# Altium schematic sheet FPGA_SDRAM1.SchDoc: RFSOC_AMC
size 420 x 297 mm; Author: G.Kasprowicz; CompanyName: WUT ISE; DrawnBy: G.Kasprowicz; Organization: WUT ISE; Address1: PW ISE; Address2: Nowowiejska 15/19 00-665 Warsaw; Address3: gkasprow@gmail.com; DocumentNumber: 12; Revision: 2; SheetNumber: 13; SheetTotal: 54; ModifiedBy: -; CheckedDate: -; Title2: 8 channel ADC & DAC; DivGrp: WUT ISE; Designer: G.Kasprowicz; ModifiedDate: -; ProjectName: Sensor Box
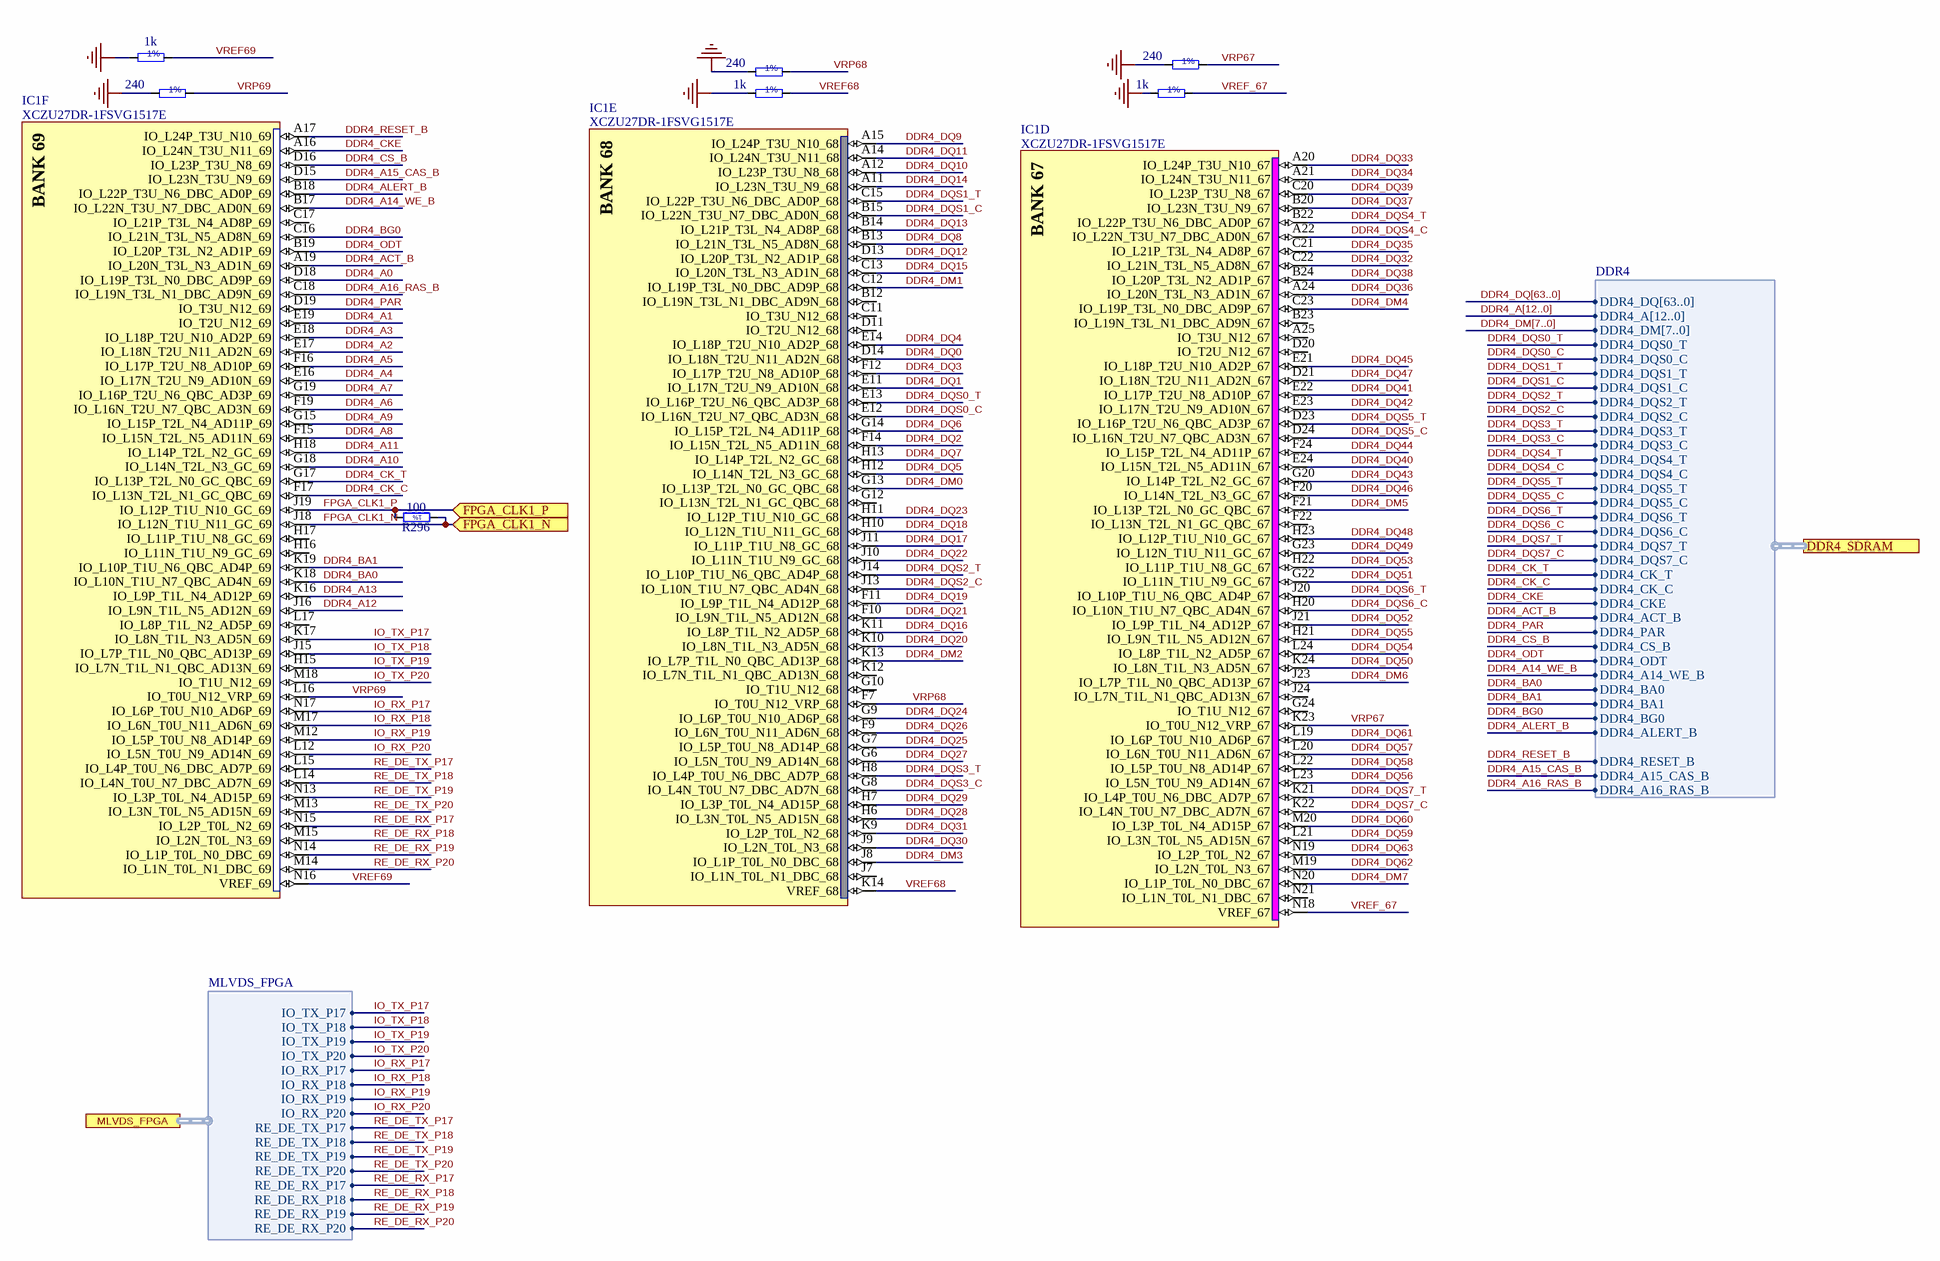
[diagram p0: FPGA_SDRAM1.SchDoc]

## Parts
IC1  XCZU27DR-1FSVG1517E  [XILINX_FSVG1517 (XCZU27DR)]  (parts D,E,F of 31)
R293  240
R294  240
R295  240
R296  100  [RESC1005X40N]
R400  1k
R451  1k
R452  1k

## Ports
DDR4_SDRAM (harness DDR4), FPGA_CLK1_N (in), FPGA_CLK1_P (in), MLVDS_FPGA (harness MLVDS_FPGA)

## Harnesses
DDR4: DDR4_DQ[63..0], DDR4_A[12..0], DDR4_DM[7..0], DDR4_DQS0_T, DDR4_DQS0_C, DDR4_DQS1_T, DDR4_DQS1_C, DDR4_DQS2_T, DDR4_DQS2_C, DDR4_DQS3_T, DDR4_DQS3_C, DDR4_DQS4_T, DDR4_DQS4_C, DDR4_DQS5_T, DDR4_DQS5_C, DDR4_DQS6_T, DDR4_DQS6_C, DDR4_DQS7_T, DDR4_DQS7_C, DDR4_CK_T, DDR4_CK_C, DDR4_CKE, DDR4_ACT_B, DDR4_PAR, DDR4_CS_B, DDR4_ODT, DDR4_A14_WE_B, DDR4_BA0, DDR4_BA1, DDR4_BG0, DDR4_ALERT_B, DDR4_RESET_B, DDR4_A15_CAS_B, DDR4_A16_RAS_B
MLVDS_FPGA: IO_TX_P17, IO_TX_P18, IO_TX_P19, IO_TX_P20, IO_RX_P17, IO_RX_P18, IO_RX_P19, IO_RX_P20, RE_DE_TX_P17, RE_DE_TX_P18, RE_DE_TX_P19, RE_DE_TX_P20, RE_DE_RX_P17, RE_DE_RX_P18, RE_DE_RX_P19, RE_DE_RX_P20

## Nets
GND: R293.1 R294.1 R295.1 R400.1 R451.1 R452.1
DDR4_A0: IC1.D18(IO_L19P_T3L_N0_DBC_AD9P_69)
DDR4_A1: IC1.E19(IO_T2U_N12_69)
DDR4_A2: IC1.E17(IO_L18N_T2U_N11_AD2N_69)
DDR4_A3: IC1.E18(IO_L18P_T2U_N10_AD2P_69)
DDR4_A4: IC1.E16(IO_L17N_T2U_N9_AD10N_69)
DDR4_A5: IC1.F16(IO_L17P_T2U_N8_AD10P_69)
DDR4_A6: IC1.F19(IO_L16N_T2U_N7_QBC_AD3N_69)
DDR4_A7: IC1.G19(IO_L16P_T2U_N6_QBC_AD3P_69)
DDR4_A8: IC1.F15(IO_L15N_T2L_N5_AD11N_69)
DDR4_A9: IC1.G15(IO_L15P_T2L_N4_AD11P_69)
DDR4_A10: IC1.G18(IO_L14N_T2L_N3_GC_69)
DDR4_A11: IC1.H18(IO_L14P_T2L_N2_GC_69)
DDR4_A12: IC1.J16(IO_L9N_T1L_N5_AD12N_69)
DDR4_A13: IC1.K16(IO_L9P_T1L_N4_AD12P_69)
DDR4_A14_WE_B: IC1.B17(IO_L22N_T3U_N7_DBC_AD0N_69) ; port DDR4_SDRAM.DDR4_A14_WE_B
DDR4_A15_CAS_B: IC1.D15(IO_L23N_T3U_N9_69) ; port DDR4_SDRAM.DDR4_A15_CAS_B
DDR4_A16_RAS_B: IC1.C18(IO_L19N_T3L_N1_DBC_AD9N_69) ; port DDR4_SDRAM.DDR4_A16_RAS_B
DDR4_ACT_B: IC1.A19(IO_L20N_T3L_N3_AD1N_69) ; port DDR4_SDRAM.DDR4_ACT_B
DDR4_ALERT_B: IC1.B18(IO_L22P_T3U_N6_DBC_AD0P_69) ; port DDR4_SDRAM.DDR4_ALERT_B
DDR4_BA0: IC1.K18(IO_L10N_T1U_N7_QBC_AD4N_69) ; port DDR4_SDRAM.DDR4_BA0
DDR4_BA1: IC1.K19(IO_L10P_T1U_N6_QBC_AD4P_69) ; port DDR4_SDRAM.DDR4_BA1
DDR4_BG0: IC1.C16(IO_L21N_T3L_N5_AD8N_69) ; port DDR4_SDRAM.DDR4_BG0
DDR4_CK_C: IC1.F17(IO_L13N_T2L_N1_GC_QBC_69) ; port DDR4_SDRAM.DDR4_CK_C
DDR4_CK_T: IC1.G17(IO_L13P_T2L_N0_GC_QBC_69) ; port DDR4_SDRAM.DDR4_CK_T
DDR4_CKE: IC1.A16(IO_L24N_T3U_N11_69) ; port DDR4_SDRAM.DDR4_CKE
DDR4_CS_B: IC1.D16(IO_L23P_T3U_N8_69) ; port DDR4_SDRAM.DDR4_CS_B
DDR4_DM0: IC1.G13(IO_L13P_T2L_N0_GC_QBC_68)
DDR4_DM1: IC1.C12(IO_L19P_T3L_N0_DBC_AD9P_68)
DDR4_DM2: IC1.K13(IO_L7P_T1L_N0_QBC_AD13P_68)
DDR4_DM3: IC1.J8(IO_L1P_T0L_N0_DBC_68)
DDR4_DM4: IC1.C23(IO_L19P_T3L_N0_DBC_AD9P_67)
DDR4_DM5: IC1.F21(IO_L13P_T2L_N0_GC_QBC_67)
DDR4_DM6: IC1.J23(IO_L7P_T1L_N0_QBC_AD13P_67)
DDR4_DM7: IC1.N20(IO_L1P_T0L_N0_DBC_67)
DDR4_DQ0: IC1.D14(IO_L18N_T2U_N11_AD2N_68)
DDR4_DQ1: IC1.E11(IO_L17N_T2U_N9_AD10N_68)
DDR4_DQ2: IC1.F14(IO_L15N_T2L_N5_AD11N_68)
DDR4_DQ3: IC1.F12(IO_L17P_T2U_N8_AD10P_68)
DDR4_DQ4: IC1.E14(IO_L18P_T2U_N10_AD2P_68)
DDR4_DQ5: IC1.H12(IO_L14N_T2L_N3_GC_68)
DDR4_DQ6: IC1.G14(IO_L15P_T2L_N4_AD11P_68)
DDR4_DQ7: IC1.H13(IO_L14P_T2L_N2_GC_68)
DDR4_DQ8: IC1.B13(IO_L21N_T3L_N5_AD8N_68)
DDR4_DQ9: IC1.A15(IO_L24P_T3U_N10_68)
DDR4_DQ10: IC1.A12(IO_L23P_T3U_N8_68)
DDR4_DQ11: IC1.A14(IO_L24N_T3U_N11_68)
DDR4_DQ12: IC1.D13(IO_L20P_T3L_N2_AD1P_68)
DDR4_DQ13: IC1.B14(IO_L21P_T3L_N4_AD8P_68)
DDR4_DQ14: IC1.A11(IO_L23N_T3U_N9_68)
DDR4_DQ15: IC1.C13(IO_L20N_T3L_N3_AD1N_68)
DDR4_DQ16: IC1.K11(IO_L8P_T1L_N2_AD5P_68)
DDR4_DQ17: IC1.J11(IO_L11P_T1U_N8_GC_68)
DDR4_DQ18: IC1.H10(IO_L12N_T1U_N11_GC_68)
DDR4_DQ19: IC1.F11(IO_L9P_T1L_N4_AD12P_68)
DDR4_DQ20: IC1.K10(IO_L8N_T1L_N3_AD5N_68)
DDR4_DQ21: IC1.F10(IO_L9N_T1L_N5_AD12N_68)
DDR4_DQ22: IC1.J10(IO_L11N_T1U_N9_GC_68)
DDR4_DQ23: IC1.H11(IO_L12P_T1U_N10_GC_68)
DDR4_DQ24: IC1.G9(IO_L6P_T0U_N10_AD6P_68)
DDR4_DQ25: IC1.G7(IO_L5P_T0U_N8_AD14P_68)
DDR4_DQ26: IC1.F9(IO_L6N_T0U_N11_AD6N_68)
DDR4_DQ27: IC1.G6(IO_L5N_T0U_N9_AD14N_68)
DDR4_DQ28: IC1.H6(IO_L3N_T0L_N5_AD15N_68)
DDR4_DQ29: IC1.H7(IO_L3P_T0L_N4_AD15P_68)
DDR4_DQ30: IC1.J9(IO_L2N_T0L_N3_68)
DDR4_DQ31: IC1.K9(IO_L2P_T0L_N2_68)
DDR4_DQ32: IC1.C22(IO_L21N_T3L_N5_AD8N_67)
DDR4_DQ33: IC1.A20(IO_L24P_T3U_N10_67)
DDR4_DQ34: IC1.A21(IO_L24N_T3U_N11_67)
DDR4_DQ35: IC1.C21(IO_L21P_T3L_N4_AD8P_67)
DDR4_DQ36: IC1.A24(IO_L20N_T3L_N3_AD1N_67)
DDR4_DQ37: IC1.B20(IO_L23N_T3U_N9_67)
DDR4_DQ38: IC1.B24(IO_L20P_T3L_N2_AD1P_67)
DDR4_DQ39: IC1.C20(IO_L23P_T3U_N8_67)
DDR4_DQ40: IC1.E24(IO_L15N_T2L_N5_AD11N_67)
DDR4_DQ41: IC1.E22(IO_L17P_T2U_N8_AD10P_67)
DDR4_DQ42: IC1.E23(IO_L17N_T2U_N9_AD10N_67)
DDR4_DQ43: IC1.G20(IO_L14P_T2L_N2_GC_67)
DDR4_DQ44: IC1.F24(IO_L15P_T2L_N4_AD11P_67)
DDR4_DQ45: IC1.E21(IO_L18P_T2U_N10_AD2P_67)
DDR4_DQ46: IC1.F20(IO_L14N_T2L_N3_GC_67)
DDR4_DQ47: IC1.D21(IO_L18N_T2U_N11_AD2N_67)
DDR4_DQ48: IC1.H23(IO_L12P_T1U_N10_GC_67)
DDR4_DQ49: IC1.G23(IO_L12N_T1U_N11_GC_67)
DDR4_DQ50: IC1.K24(IO_L8N_T1L_N3_AD5N_67)
DDR4_DQ51: IC1.G22(IO_L11N_T1U_N9_GC_67)
DDR4_DQ52: IC1.J21(IO_L9P_T1L_N4_AD12P_67)
DDR4_DQ53: IC1.H22(IO_L11P_T1U_N8_GC_67)
DDR4_DQ54: IC1.L24(IO_L8P_T1L_N2_AD5P_67)
DDR4_DQ55: IC1.H21(IO_L9N_T1L_N5_AD12N_67)
DDR4_DQ56: IC1.L23(IO_L5N_T0U_N9_AD14N_67)
DDR4_DQ57: IC1.L20(IO_L6N_T0U_N11_AD6N_67)
DDR4_DQ58: IC1.L22(IO_L5P_T0U_N8_AD14P_67)
DDR4_DQ59: IC1.L21(IO_L3N_T0L_N5_AD15N_67)
DDR4_DQ60: IC1.M20(IO_L3P_T0L_N4_AD15P_67)
DDR4_DQ61: IC1.L19(IO_L6P_T0U_N10_AD6P_67)
DDR4_DQ62: IC1.M19(IO_L2N_T0L_N3_67)
DDR4_DQ63: IC1.N19(IO_L2P_T0L_N2_67)
DDR4_DQS0_C: IC1.E12(IO_L16N_T2U_N7_QBC_AD3N_68) ; port DDR4_SDRAM.DDR4_DQS0_C
DDR4_DQS0_T: IC1.E13(IO_L16P_T2U_N6_QBC_AD3P_68) ; port DDR4_SDRAM.DDR4_DQS0_T
DDR4_DQS1_C: IC1.B15(IO_L22N_T3U_N7_DBC_AD0N_68) ; port DDR4_SDRAM.DDR4_DQS1_C
DDR4_DQS1_T: IC1.C15(IO_L22P_T3U_N6_DBC_AD0P_68) ; port DDR4_SDRAM.DDR4_DQS1_T
DDR4_DQS2_C: IC1.J13(IO_L10N_T1U_N7_QBC_AD4N_68) ; port DDR4_SDRAM.DDR4_DQS2_C
DDR4_DQS2_T: IC1.J14(IO_L10P_T1U_N6_QBC_AD4P_68) ; port DDR4_SDRAM.DDR4_DQS2_T
DDR4_DQS3_C: IC1.G8(IO_L4N_T0U_N7_DBC_AD7N_68) ; port DDR4_SDRAM.DDR4_DQS3_C
DDR4_DQS3_T: IC1.H8(IO_L4P_T0U_N6_DBC_AD7P_68) ; port DDR4_SDRAM.DDR4_DQS3_T
DDR4_DQS4_C: IC1.A22(IO_L22N_T3U_N7_DBC_AD0N_67) ; port DDR4_SDRAM.DDR4_DQS4_C
DDR4_DQS4_T: IC1.B22(IO_L22P_T3U_N6_DBC_AD0P_67) ; port DDR4_SDRAM.DDR4_DQS4_T
DDR4_DQS5_C: IC1.D24(IO_L16N_T2U_N7_QBC_AD3N_67) ; port DDR4_SDRAM.DDR4_DQS5_C
DDR4_DQS5_T: IC1.D23(IO_L16P_T2U_N6_QBC_AD3P_67) ; port DDR4_SDRAM.DDR4_DQS5_T
DDR4_DQS6_C: IC1.H20(IO_L10N_T1U_N7_QBC_AD4N_67) ; port DDR4_SDRAM.DDR4_DQS6_C
DDR4_DQS6_T: IC1.J20(IO_L10P_T1U_N6_QBC_AD4P_67) ; port DDR4_SDRAM.DDR4_DQS6_T
DDR4_DQS7_C: IC1.K22(IO_L4N_T0U_N7_DBC_AD7N_67) ; port DDR4_SDRAM.DDR4_DQS7_C
DDR4_DQS7_T: IC1.K21(IO_L4P_T0U_N6_DBC_AD7P_67) ; port DDR4_SDRAM.DDR4_DQS7_T
DDR4_ODT: IC1.B19(IO_L20P_T3L_N2_AD1P_69) ; port DDR4_SDRAM.DDR4_ODT
DDR4_PAR: IC1.D19(IO_T3U_N12_69) ; port DDR4_SDRAM.DDR4_PAR
DDR4_RESET_B: IC1.A17(IO_L24P_T3U_N10_69) ; port DDR4_SDRAM.DDR4_RESET_B
FPGA_CLK1_N: IC1.J18(IO_L12N_T1U_N11_GC_69) R296.2 ; port FPGA_CLK1_N
FPGA_CLK1_P: IC1.J19(IO_L12P_T1U_N10_GC_69) R296.1 ; port FPGA_CLK1_P
IO_RX_P17: IC1.N17(IO_L6P_T0U_N10_AD6P_69) ; port MLVDS_FPGA.IO_RX_P17
IO_RX_P18: IC1.M17(IO_L6N_T0U_N11_AD6N_69) ; port MLVDS_FPGA.IO_RX_P18
IO_RX_P19: IC1.M12(IO_L5P_T0U_N8_AD14P_69) ; port MLVDS_FPGA.IO_RX_P19
IO_RX_P20: IC1.L12(IO_L5N_T0U_N9_AD14N_69) ; port MLVDS_FPGA.IO_RX_P20
IO_TX_P17: IC1.K17(IO_L8N_T1L_N3_AD5N_69) ; port MLVDS_FPGA.IO_TX_P17
IO_TX_P18: IC1.J15(IO_L7P_T1L_N0_QBC_AD13P_69) ; port MLVDS_FPGA.IO_TX_P18
IO_TX_P19: IC1.H15(IO_L7N_T1L_N1_QBC_AD13N_69) ; port MLVDS_FPGA.IO_TX_P19
IO_TX_P20: IC1.M18(IO_T1U_N12_69) ; port MLVDS_FPGA.IO_TX_P20
RE_DE_RX_P17: IC1.N15(IO_L2P_T0L_N2_69) ; port MLVDS_FPGA.RE_DE_RX_P17
RE_DE_RX_P18: IC1.M15(IO_L2N_T0L_N3_69) ; port MLVDS_FPGA.RE_DE_RX_P18
RE_DE_RX_P19: IC1.N14(IO_L1P_T0L_N0_DBC_69) ; port MLVDS_FPGA.RE_DE_RX_P19
RE_DE_RX_P20: IC1.M14(IO_L1N_T0L_N1_DBC_69) ; port MLVDS_FPGA.RE_DE_RX_P20
RE_DE_TX_P17: IC1.L15(IO_L4P_T0U_N6_DBC_AD7P_69) ; port MLVDS_FPGA.RE_DE_TX_P17
RE_DE_TX_P18: IC1.L14(IO_L4N_T0U_N7_DBC_AD7N_69) ; port MLVDS_FPGA.RE_DE_TX_P18
RE_DE_TX_P19: IC1.N13(IO_L3P_T0L_N4_AD15P_69) ; port MLVDS_FPGA.RE_DE_TX_P19
RE_DE_TX_P20: IC1.M13(IO_L3N_T0L_N5_AD15N_69) ; port MLVDS_FPGA.RE_DE_TX_P20
VREF68: IC1.K14(VREF_68) R451.2
VREF69: IC1.N16(VREF_69) R400.2
VREF_67: IC1.N18(VREF_67) R452.2
VRP67: IC1.K23(IO_T0U_N12_VRP_67) R295.2
VRP68: IC1.F7(IO_T0U_N12_VRP_68) R294.2
VRP69: IC1.L16(IO_T0U_N12_VRP_69) R293.2

Not connected (* = marked no-connect by the designer): IC1 A25(IO_T3U_N12_67) B12(IO_L19N_T3L_N1_DBC_AD9N_68) B23(IO_L19N_T3L_N1_DBC_AD9N_67) C11(IO_T3U_N12_68) C17(IO_L21P_T3L_N4_AD8P_69) D11(IO_T2U_N12_68) D20(IO_T2U_N12_67) F22(IO_L13N_T2L_N1_GC_QBC_67) G10(IO_T1U_N12_68) G12(IO_L13N_T2L_N1_GC_QBC_68) G24(IO_T1U_N12_67) H16(IO_L11N_T1U_N9_GC_69) H17(IO_L11P_T1U_N8_GC_69) J7(IO_L1N_T0L_N1_DBC_68) J24(IO_L7N_T1L_N1_QBC_AD13N_67) K12(IO_L7N_T1L_N1_QBC_AD13N_68) L17(IO_L8P_T1L_N2_AD5P_69) N21(IO_L1N_T0L_N1_DBC_67)

## Buses and harness runs
bus DDR4_A[12..0]
bus DDR4_DM[7..0]
bus DDR4_DQ[63..0]

## Notes on the sheet
- Project/Equipment
- Document
- Designer
- Drawn by
- Check.by
- Copyright WUT ISE 2019.
  This documentation describes Open Hardware and is licensed under the CERN OHL v.1.1. You may redistribute and modify this documentation under the terms of the CERN OHL v.1.1. (http://ohwr.org/CERNOHL). This documentation is distributed WITHOUT ANY EXPRESS OR IMPLIED WARRANTY, INCLUDING OF MERCHANTABILITY, SATISFACTORY QUALITY AND FITNESS FOR A PARTICULAR PURPOSE. Please see the CERN OHL v.1.1 for applicable conditions.
- Contact
- File
- Last Mod.
- Print Date
- Sheet
- Size
- A3
- of
- Rev
- (in symbol R293) 1%
- (in symbol R294) 1%
- (in symbol R295) 1%
- (in symbol R400) 1%
- (in symbol R0402_100R_1%_0.0625W_100PPM) 1%
- (in symbol R451) 1%
- (in symbol R452) 1%
- (in symbol XCZU27DR-1FSVG1517E, part D) BANK 67
- (in symbol XCZU27DR-1FSVG1517E, part E) BANK 68
- (in symbol XCZU27DR-1FSVG1517E, part F) BANK 69

## Library data of the parts
IC1 = XCZU27DR-1FSVG1517E: Zynq UltraScale+ RFSoC, Quad-Core ARM® Cortex™-A53 MPCore™ up to 1.5GHz, 214 PS I/O, 299 HP I/O, 48 HD I/O, 1517-Pin BGA; Manufacturer: XILINX; PressFit: No; Bonding: No; Part Number: XCZU27DR-1FSVG1517E; Component Kind: Standard; Component Type: Standard; Device: XCZU27DR-1FSVG1517E; PackageDescription: BGA, 1.00mm Pitch, Square; 1517 Pin, 39 Columns X 39 Rows, 40.00mm X 40.00mm X 4.01mm H; Part Description: Zynq UltraScale+ RFSoC, Quad-Core ARM® Cortex™-A53 MPCore™ up to 1.5GHz, 214 PS I/O, 299 HP I/O, 48 HD I/O, 1517-Pin BGA; Manufacturer Part Number: XCZU27DR-1FSVG1517E; Pin Count: 1517; Case: BGA1517; Mounted: Yes; Socket: No; SMD: Yes; Sense: No; ComponentHeight: 4.01mm; HelpURL: \\cern.ch\dfs\Applications\Altium\Datasheets\XCZU27DR-1FSVG1517E.pdf; ComponentLink1URL: \\cern.ch\dfs\Applications\Altium\Datasheets\XCZU27DR-1FSVG1517E_Package-Pinout.pdf; ComponentLink1Description: Package/Pinout; ComponentLink2URL: \\cern.ch\dfs\Applications\Altium\Datasheets\XCZU27DR-1FSVG1517E_Pinout.pdf; ComponentLink2Description: Pinout; Author: CERN DEM MR; CreateDate: 02/05/2018; LatestRevisionDate: 02/05/2018
R293 = (no symbol name): $$NotCommonProperty_General Part Number: R0402_240R_1%_0.0625W_100PPM; $$NotCommonProperty_Manufacturer1 Example: YAGEO PHYCOMP; $$NotCommonProperty_Manufacturer1 Part Number: 232270672401L; Manufacturer: GENERIC; Part Description: General Purpose Thick Film Chip Resistor; Part Name: Resistor - 1% RESC1005X40N; $$Internal_Resolution: 00001mm; $$NotCommonProperty_Case: 0402; $$NotCommonProperty_Cell: RESC1005X40N; $$NotCommonProperty_Pin Count: 2; $$NotCommonProperty_Power: 0.0625W; $$NotCommonProperty_Sense: No; $$NotCommonProperty_SMD: Yes; $$NotCommonProperty_Status: Not recommended; $$NotCommonProperty_TC: ±100ppm/°C; CmpIndex: 232; DXDB_LIBNAME: Resistors SMD; Ref Designator: R293; SymIndex: 317; Tolerance: ±1%; $$Internal___BlkDate: 18:43:16_11-19-16; $$NotCommonProperty_Manufacturer1 ComponentHeight: 0.4mm; Cell Name: RESC1005X40N; Manufacturer Part Number: R0402_240R_1%_0.0625W_100PPM; Part Number: Resistor - 1% RESC1005X40N; Value: 240; Orientation: 0 = 0
R294 = (no symbol name): $$NotCommonProperty_General Part Number: R0402_240R_1%_0.0625W_100PPM; $$NotCommonProperty_Manufacturer1 Example: YAGEO PHYCOMP; $$NotCommonProperty_Manufacturer1 Part Number: 232270672401L; Manufacturer: GENERIC; Part Description: General Purpose Thick Film Chip Resistor; Part Name: Resistor - 1% RESC1005X40N; $$Internal_Resolution: 00001mm; $$NotCommonProperty_Case: 0402; $$NotCommonProperty_Cell: RESC1005X40N; $$NotCommonProperty_Pin Count: 2; $$NotCommonProperty_Power: 0.0625W; $$NotCommonProperty_Sense: No; $$NotCommonProperty_SMD: Yes; $$NotCommonProperty_Status: Not recommended; $$NotCommonProperty_TC: ±100ppm/°C; CmpIndex: 235; DXDB_LIBNAME: Resistors SMD; Ref Designator: R294; SymIndex: 317; Tolerance: ±1%; $$Internal___BlkDate: 18:43:16_11-19-16; $$NotCommonProperty_Manufacturer1 ComponentHeight: 0.4mm; Cell Name: RESC1005X40N; Manufacturer Part Number: R0402_240R_1%_0.0625W_100PPM; Part Number: Resistor - 1% RESC1005X40N; Value: 240; Orientation: 0 = 0
R295 = (no symbol name): $$NotCommonProperty_General Part Number: R0402_240R_1%_0.0625W_100PPM; $$NotCommonProperty_Manufacturer1 Example: YAGEO PHYCOMP; $$NotCommonProperty_Manufacturer1 Part Number: 232270672401L; Manufacturer: GENERIC; Part Description: General Purpose Thick Film Chip Resistor; Part Name: Resistor - 1% RESC1005X40N; $$Internal_Resolution: 00001mm; $$NotCommonProperty_Case: 0402; $$NotCommonProperty_Cell: RESC1005X40N; $$NotCommonProperty_Pin Count: 2; $$NotCommonProperty_Power: 0.0625W; $$NotCommonProperty_Sense: No; $$NotCommonProperty_SMD: Yes; $$NotCommonProperty_Status: Not recommended; $$NotCommonProperty_TC: ±100ppm/°C; CmpIndex: 237; DXDB_LIBNAME: Resistors SMD; Ref Designator: R295; SymIndex: 317; Tolerance: ±1%; $$Internal___BlkDate: 18:43:16_11-19-16; $$NotCommonProperty_Manufacturer1 ComponentHeight: 0.4mm; Cell Name: RESC1005X40N; Manufacturer Part Number: R0402_240R_1%_0.0625W_100PPM; Part Number: Resistor - 1% RESC1005X40N; Value: 240; Orientation: 0 = 0
R296 = R0402_100R_1%_0.0625W_100PPM: Resistor - 1%; Manufacturer: GENERIC; Part Description: General Purpose Thick Film Chip Resistor; Manufacturer1 Part Number: 232270671001L; TC: ±100ppm/°C; PressFit: No; Manufacturer Part Number: R0402_100R_1%_0.0625W_100PPM; Part Number: R0402_100R_1%_0.0625W_100PPM; Tolerance: ±1%; Value: 100; Component Kind: Standard; Component Type: Standard; Pin Count: 2; Status: Not Recommended; Power: 0.0625W; Case: 0402; Mounted: Yes; Sense: No; Socket: No; SMD: Yes; Manufacturer1 Example: YAGEO PHYCOMP; Manufacturer1 ComponentHeight: 0.4mm; HelpURL: \\cern.ch\dfs\Applications\Altium\Datasheets\R0402_Phycomp_RC0402.pdf; Author: CERN DEM JLC; CreateDate: 03/12/2007; LatestRevisionDate: 17/10/2012
R400 = (no symbol name): $$NotCommonProperty_General Part Number: R0402_1K_1%_0.0625W_100PPM; $$NotCommonProperty_Manufacturer1 Example: YAGEO PHYCOMP; $$NotCommonProperty_Manufacturer1 Part Number: 232270671002L; Manufacturer: GENERIC; Part Description: General Purpose Thick Film Chip Resistor; Part Name: Resistor - 1% RESC1005X40N; $$Internal_Resolution: 00001mm; $$NotCommonProperty_Case: 0402; $$NotCommonProperty_Pin Count: 2; $$NotCommonProperty_Power: 0.0625W; $$NotCommonProperty_Sense: No; $$NotCommonProperty_SMD: Yes; $$NotCommonProperty_Status: Not recommended; $$NotCommonProperty_TC: ±100ppm/°C; Cell Name: RESC1005X40N; CmpIndex: 535; DXDB_LIBNAME: Resistors SMD; Ref Designator: R400; SymIndex: 317; Tolerance: ±1%; $$Internal___BlkDate: 18:43:16_11-19-16; $$NotCommonProperty_Manufacturer1 ComponentHeight: 0.4mm; Manufacturer Part Number: R0402_1K_1%_0.0625W_100PPM; Part Number: Resistor - 1% RESC1005X40N; Value: 1k; Orientation: 0 = 0
R451 = (no symbol name): $$NotCommonProperty_General Part Number: R0402_1K_1%_0.0625W_100PPM; $$NotCommonProperty_Manufacturer1 Example: YAGEO PHYCOMP; $$NotCommonProperty_Manufacturer1 Part Number: 232270671002L; Manufacturer: GENERIC; Part Description: General Purpose Thick Film Chip Resistor; Part Name: Resistor - 1% RESC1005X40N; $$Internal_Resolution: 00001mm; $$NotCommonProperty_Case: 0402; $$NotCommonProperty_Pin Count: 2; $$NotCommonProperty_Power: 0.0625W; $$NotCommonProperty_Sense: No; $$NotCommonProperty_SMD: Yes; $$NotCommonProperty_Status: Not recommended; $$NotCommonProperty_TC: ±100ppm/°C; Cell Name: RESC1005X40N; CmpIndex: 538; DXDB_LIBNAME: Resistors SMD; Ref Designator: R451; SymIndex: 317; Tolerance: ±1%; $$Internal___BlkDate: 18:43:16_11-19-16; $$NotCommonProperty_Manufacturer1 ComponentHeight: 0.4mm; Manufacturer Part Number: R0402_1K_1%_0.0625W_100PPM; Part Number: Resistor - 1% RESC1005X40N; Value: 1k; Orientation: 0 = 0
R452 = (no symbol name): $$NotCommonProperty_General Part Number: R0402_1K_1%_0.0625W_100PPM; $$NotCommonProperty_Manufacturer1 Example: YAGEO PHYCOMP; $$NotCommonProperty_Manufacturer1 Part Number: 232270671002L; Manufacturer: GENERIC; Part Description: General Purpose Thick Film Chip Resistor; Part Name: Resistor - 1% RESC1005X40N; $$Internal_Resolution: 00001mm; $$NotCommonProperty_Case: 0402; $$NotCommonProperty_Pin Count: 2; $$NotCommonProperty_Power: 0.0625W; $$NotCommonProperty_Sense: No; $$NotCommonProperty_SMD: Yes; $$NotCommonProperty_Status: Not recommended; $$NotCommonProperty_TC: ±100ppm/°C; Cell Name: RESC1005X40N; CmpIndex: 62; DXDB_LIBNAME: Resistors SMD; Ref Designator: R452; SymIndex: 317; Tolerance: ±1%; $$Internal___BlkDate: 18:43:16_11-19-16; $$NotCommonProperty_Manufacturer1 ComponentHeight: 0.4mm; Manufacturer Part Number: R0402_1K_1%_0.0625W_100PPM; Part Number: Resistor - 1% RESC1005X40N; Value: 1k; Orientation: 0 = 0